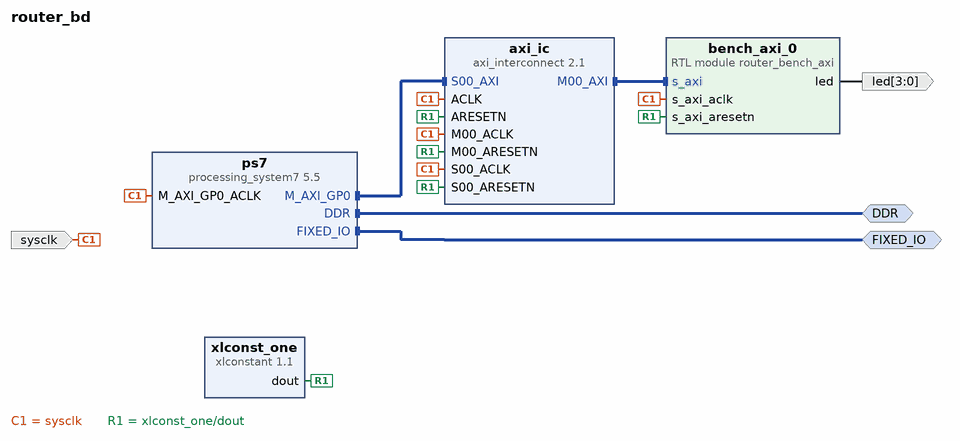
[diagram p0: block diagram of the top level]
# Vivado block design router_bd, xc7z020clg400-1, Vivado 2025.1
create_bd_design router_bd

create_bd_intf_port -mode Master -vlnv xilinx.com:interface:ddrx_rtl:1.0 DDR
create_bd_intf_port -mode Master -vlnv xilinx.com:display_processing_system7:fixedio_rtl:1.0 FIXED_IO
create_bd_port -dir I -type clk sysclk
set_property -dict {CONFIG.FREQ_HZ 125000000} [get_bd_ports sysclk]
create_bd_port -dir O -from 3 -to 0 led

create_bd_cell -type ip -vlnv xilinx.com:ip:processing_system7:5.5 ps7
# 2 more settings of ps7 are not shown: defaults, MIO pin electricals, DDR timing, and values the tool derives
create_bd_cell -type ip -vlnv xilinx.com:ip:axi_interconnect:2.1 axi_ic
set_property -dict {CONFIG.NUM_MI 1} [get_bd_cells axi_ic]
create_bd_cell -type module -reference router_bench_axi bench_axi_0
create_bd_cell -type ip -vlnv xilinx.com:ip:xlconstant:1.1 xlconst_one
set_property -dict {CONFIG.CONST_VAL 1} [get_bd_cells xlconst_one]

# ---- connections ----

connect_bd_intf_net [get_bd_intf_pins bench_axi_0/s_axi] [get_bd_intf_pins axi_ic/M00_AXI]
connect_bd_intf_net [get_bd_intf_ports DDR] [get_bd_intf_pins ps7/DDR]
connect_bd_intf_net [get_bd_intf_ports FIXED_IO] [get_bd_intf_pins ps7/FIXED_IO]
connect_bd_intf_net [get_bd_intf_pins ps7/M_AXI_GP0] [get_bd_intf_pins axi_ic/S00_AXI]
connect_bd_net [get_bd_pins bench_axi_0/led] [get_bd_ports led]
connect_bd_net [get_bd_ports sysclk] \
  [get_bd_pins axi_ic/ACLK] [get_bd_pins axi_ic/S00_ACLK] [get_bd_pins axi_ic/M00_ACLK] [get_bd_pins bench_axi_0/s_axi_aclk] \
  [get_bd_pins ps7/M_AXI_GP0_ACLK]
connect_bd_net [get_bd_pins xlconst_one/dout] \
  [get_bd_pins bench_axi_0/s_axi_aresetn] [get_bd_pins axi_ic/ARESETN] [get_bd_pins axi_ic/S00_ARESETN] \
  [get_bd_pins axi_ic/M00_ARESETN]

# ---- address map ----
assign_bd_address -offset 0x43C00000 -range 4K -target_address_space [get_bd_addr_spaces ps7/Data] [get_bd_addr_segs bench_axi_0/s_axi/reg0]

validate_bd_design
save_bd_design
